# Altium schematic sheet BMD-300-Eval_Top.SchDoc: BMD-300
size B; CompanyName: Rigado, LLC; Organization: Rigado; SheetNumber: 1; Website: www.rigado.com; SheetSize: B; SheetTitle: BMD-300
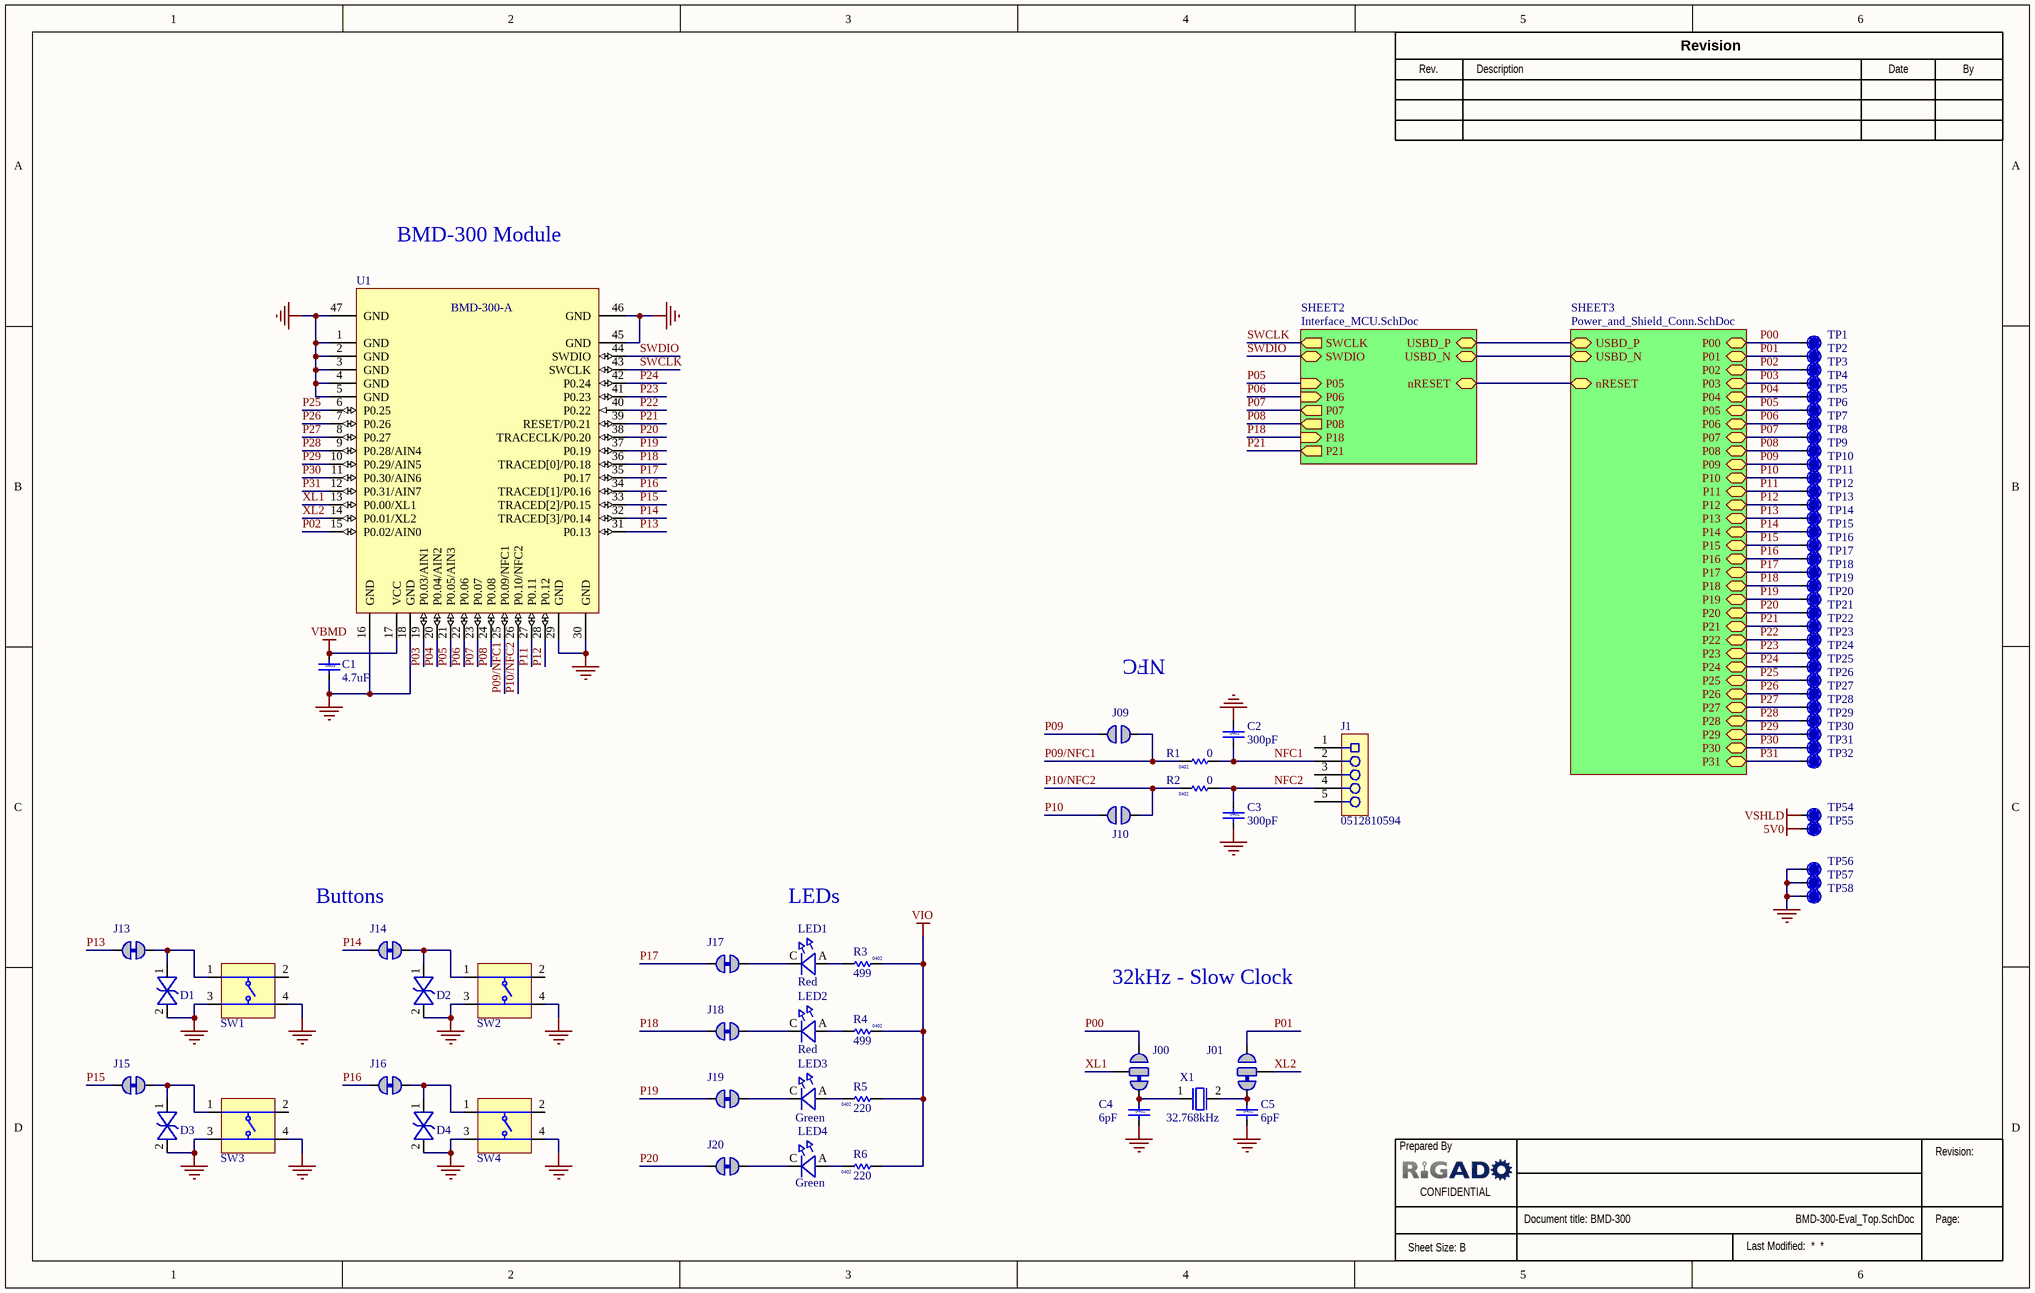
[diagram p0: BMD-300-Eval_Top.SchDoc]

## Parts
(Parts that share a designator on the sheet are numbered #1, #2 ... from top to bottom, then left to right.)
?#1  (no value)  (graphical)
?#2  (no value)  (graphical)
C1  value 4.7uF  Size: 0603  [Cap 0603 HD]  (hidden comment: 120-000324.7uF)
C2  value 300pF  Size: 0402  [Cap 0402 HD]  (hidden comment: 120-00099300pF)
C3  value 300pF  Size: 0402  [Cap 0402 HD]  (hidden comment: 120-00099300pF)
C4  value 6pF  Size: 0402  [Cap 0402 HD]  (hidden comment: 120-000486pF)
C5  value 6pF  Size: 0402  [Cap 0402 HD]  (hidden comment: 120-000486pF)
D1  110-00019  [SOD-923]  (value not drawn)
D2  110-00019  [SOD-923]  (value not drawn)
D3  110-00019  [SOD-923]  (value not drawn)
D4  110-00019  [SOD-923]  (value not drawn)
J00  Solderbridge-OptionDNP  [Solderbridge-Option]  (value not drawn)  (net tie, no BOM)
J1  Manufacturer P/N: 0512810594  [Molex 051281-0594]  (hidden comment: 130-00098)
J01  Solderbridge-OptionDNP  [Solderbridge-Option]  (value not drawn)  (net tie, no BOM)
J09  Solderbridge-OpenDNP  [Solderbridge-Open]  (value not drawn)  (no BOM)
J10  Solderbridge-OpenDNP  [Solderbridge-Open]  (value not drawn)  (no BOM)
J13  Solderbridge-ShortDNP  [Solderbridge-Short]  (value not drawn)  (net tie, no BOM)
J14  Solderbridge-ShortDNP  [Solderbridge-Short]  (value not drawn)  (net tie, no BOM)
J15  Solderbridge-ShortDNP  [Solderbridge-Short]  (value not drawn)  (net tie, no BOM)
J16  Solderbridge-ShortDNP  [Solderbridge-Short]  (value not drawn)  (net tie, no BOM)
J17  Solderbridge-ShortDNP  [Solderbridge-Short]  (value not drawn)  (net tie, no BOM)
J18  Solderbridge-ShortDNP  [Solderbridge-Short]  (value not drawn)  (net tie, no BOM)
J19  Solderbridge-ShortDNP  [Solderbridge-Short]  (value not drawn)  (net tie, no BOM)
J20  Solderbridge-ShortDNP  [Solderbridge-Short]  (value not drawn)  (net tie, no BOM)
LED1  Color: Red  [Diode 0603 HD]  (hidden comment: 115-00020)
LED2  Color: Red  [Diode 0603 HD]  (hidden comment: 115-00020)
LED3  Color: Green  [Diode 0603 HD]  (hidden comment: 115-00019)
LED4  Color: Green  [Diode 0603 HD]  (hidden comment: 115-00019)
R1  value 0  Size: 0402  [RES 0402 HD]  (hidden comment: 180-000200)
R2  value 0  Size: 0402  [RES 0402 HD]  (hidden comment: 180-000200)
R3  value 499  Size: 0402  [RES 0402 HD]  (hidden comment: 180-00031499)
R4  value 499  Size: 0402  [RES 0402 HD]  (hidden comment: 180-00031499)
R5  value 220  Size: 0402  [RES 0402 HD]  (hidden comment: 180-00098220)
R6  value 220  Size: 0402  [RES 0402 HD]  (hidden comment: 180-00098220)
SW1  135-00002  [SW_TACT_SMT_6mm]  (value not drawn)
SW2  135-00002  [SW_TACT_SMT_6mm]  (value not drawn)
SW3  135-00002  [SW_TACT_SMT_6mm]  (value not drawn)
SW4  135-00002  [SW_TACT_SMT_6mm]  (value not drawn)
TP1  TP  [TP10R]  (value not drawn)
TP2  TP  [TP10R]  (value not drawn)
TP3  TP  [TP10R]  (value not drawn)
TP4  TP  [TP10R]  (value not drawn)
TP5  TP  [TP10R]  (value not drawn)
TP6  TP  [TP10R]  (value not drawn)
TP7  TP  [TP10R]  (value not drawn)
TP8  TP  [TP10R]  (value not drawn)
TP9  TP  [TP10R]  (value not drawn)
TP10  TP  [TP10R]  (value not drawn)
TP11  TP  [TP10R]  (value not drawn)
TP12  TP  [TP10R]  (value not drawn)
TP13  TP  [TP10R]  (value not drawn)
TP14  TP  [TP10R]  (value not drawn)
TP15  TP  [TP10R]  (value not drawn)
TP16  TP  [TP10R]  (value not drawn)
TP17  TP  [TP10R]  (value not drawn)
TP18  TP  [TP10R]  (value not drawn)
TP19  TP  [TP10R]  (value not drawn)
TP20  TP  [TP10R]  (value not drawn)
TP21  TP  [TP10R]  (value not drawn)
TP22  TP  [TP10R]  (value not drawn)
TP23  TP  [TP10R]  (value not drawn)
TP24  TP  [TP10R]  (value not drawn)
TP25  TP  [TP10R]  (value not drawn)
TP26  TP  [TP10R]  (value not drawn)
TP27  TP  [TP10R]  (value not drawn)
TP28  TP  [TP10R]  (value not drawn)
TP29  TP  [TP10R]  (value not drawn)
TP30  TP  [TP10R]  (value not drawn)
TP31  TP  [TP10R]  (value not drawn)
TP32  TP  [TP10R]  (value not drawn)
TP54  TP  [TP10R]  (value not drawn)
TP55  TP  [TP10R]  (value not drawn)
TP56  TP  [TP10R]  (value not drawn)
TP57  TP  [TP10R]  (value not drawn)
TP58  TP  [TP10R]  (value not drawn)
U1  Manufacturer P/N: BMD-300-A  [BMD-300]  (hidden comment: 205-00011)
X1  Frequency: 32.768kHz  [XTAL_3215]  (hidden comment: 100-00005)

## Sub-sheets
SHEET2 = Interface_MCU.SchDoc: USBD_N (bidir), USBD_P (bidir), P21 (out), P18 (in), P08 (out), P06 (in), P07 (out), P05 (in), SWCLK (out), SWDIO (bidir), nRESET (bidir)
SHEET3 = Power_and_Shield_Conn.SchDoc: P00 (bidir), P01 (bidir), P02 (bidir), P03 (bidir), P04 (bidir), P05 (bidir), P06 (bidir), P07 (bidir), P08 (bidir), P09 (bidir), P10 (bidir), P11 (bidir), P14 (bidir), P15 (bidir), P16 (bidir), P12 (bidir), P13 (bidir), P17 (bidir), P18 (bidir), P19 (bidir), P20 (bidir), P21 (bidir), P22 (bidir), P23 (bidir), P24 (bidir), P25 (bidir), P26 (bidir), P27 (bidir), P28 (bidir), P29 (bidir), P30 (bidir), P31 (bidir), USBD_P (bidir), USBD_N (bidir), nRESET (bidir)

## Nets
5V0: TP55.1
GND: C1.2 C2.1 C3.2 C4.2 C5.2 D1.2 D2.2 D3.2 D4.2 SW1.3(T3) SW1.4(T3) SW2.3(T3) SW2.4(T3) SW3.3(T3) SW3.4(T3) SW4.3(T3) SW4.4(T3) TP56.1 TP57.1 TP58.1 U1.1(GND) U1.2(GND) U1.3(GND) U1.4(GND) U1.5(GND) U1.16(GND) U1.18(GND) U1.29(GND) U1.30(GND) U1.45(GND) U1.46(GND) U1.47(GND)
VBMD: C1.1 U1.17(VCC)
VIO: R3.2 R4.2 R5.1 R6.1
VSHLD: TP54.1
NFC1: C2.2 J1.2 R1.1
NFC2: C3.1 J1.4 R2.1
P00: J00.3 TP1.1 ; sheet SHEET3/P00
P01: J01.3 TP2.1 ; sheet SHEET3/P01
P02: TP3.1 U1.15(P0.02/AIN0) ; sheet SHEET3/P02
P03: TP4.1 U1.19(P0.03/AIN1) ; sheet SHEET3/P03
P04: TP5.1 U1.20(P0.04/AIN2) ; sheet SHEET3/P04
P05: TP6.1 U1.21(P0.05/AIN3) ; sheet SHEET3/P05, sheet SHEET2/P05
P06: TP7.1 U1.22(P0.06) ; sheet SHEET3/P06, sheet SHEET2/P06
P07: TP8.1 U1.23(P0.07) ; sheet SHEET3/P07, sheet SHEET2/P07
P08: TP9.1 U1.24(P0.08) ; sheet SHEET3/P08, sheet SHEET2/P08
P09: J09.2 TP10.1 ; sheet SHEET3/P09
P09/NFC1: J09.1 R1.2 U1.25(P0.09/NFC1)
P10: J10.2 TP11.1 ; sheet SHEET3/P10
P10/NFC2: J10.1 R2.2 U1.26(P0.10/NFC2)
P11: TP12.1 U1.27(P0.11) ; sheet SHEET3/P11
P12: TP13.1 U1.28(P0.12) ; sheet SHEET3/P12
P13: J13.2 TP14.1 U1.31(P0.13) ; sheet SHEET3/P13
P14: J14.2 TP15.1 U1.32(TRACED[3]/P0.14) ; sheet SHEET3/P14
P15: J15.2 TP16.1 U1.33(TRACED[2]/P0.15) ; sheet SHEET3/P15
P16: J16.2 TP17.1 U1.34(TRACED[1]/P0.16) ; sheet SHEET3/P16
P17: J17.2 TP18.1 U1.35(P0.17) ; sheet SHEET3/P17
P18: J18.2 TP19.1 U1.36(TRACED[0]/P0.18) ; sheet SHEET3/P18, sheet SHEET2/P18
P19: J19.2 TP20.1 U1.37(P0.19) ; sheet SHEET3/P19
P20: J20.2 TP21.1 U1.38(TRACECLK/P0.20) ; sheet SHEET3/P20
P21: TP22.1 U1.39(RESET/P0.21) ; sheet SHEET3/P21, sheet SHEET2/P21
P22: TP23.1 U1.40(P0.22) ; sheet SHEET3/P22
P23: TP24.1 U1.41(P0.23) ; sheet SHEET3/P23
P24: TP25.1 U1.42(P0.24) ; sheet SHEET3/P24
P25: TP26.1 U1.6(P0.25) ; sheet SHEET3/P25
P26: TP27.1 U1.7(P0.26) ; sheet SHEET3/P26
P27: TP28.1 U1.8(P0.27) ; sheet SHEET3/P27
P28: TP29.1 U1.9(P0.28/AIN4) ; sheet SHEET3/P28
P29: TP30.1 U1.10(P0.29/AIN5) ; sheet SHEET3/P29
P30: TP31.1 U1.11(P0.30/AIN6) ; sheet SHEET3/P30
P31: TP32.1 U1.12(P0.31/AIN7) ; sheet SHEET3/P31
SWCLK: U1.43(SWCLK) ; sheet SHEET2/SWCLK
SWDIO: U1.44(SWDIO) ; sheet SHEET2/SWDIO
XL1: J00.2 U1.13(P0.00/XL1)
XL2: J01.2 U1.14(P0.01/XL2)
NetC4_1: C4.1 J00.1 X1.1
NetC5_1: C5.1 J01.1 X1.2
NetD1_1: D1.1 J13.1 SW1.1(T1)
NetD2_1: D2.1 J14.1 SW2.1(T1)
NetD3_1: D3.1 J15.1 SW3.1(T1)
NetD4_1: D4.1 J16.1 SW4.1(T1)
NetJ17_1: J17.1 LED1.C(Cathode)
NetJ18_1: J18.1 LED2.C(Cathode)
NetJ19_1: J19.1 LED3.C(Cathode)
NetJ20_1: J20.1 LED4.C(Cathode)
NetLED1_A: LED1.A(Anode) R3.1
NetLED2_A: LED2.A(Anode) R4.1
NetLED3_A: LED3.A(Anode) R5.2
NetLED4_A: LED4.A(Anode) R6.2
(unnamed): sheet SHEET3/USBD_P, sheet SHEET2/USBD_P
(unnamed): sheet SHEET3/USBD_N, sheet SHEET2/USBD_N
(unnamed): sheet SHEET3/nRESET, sheet SHEET2/nRESET

Not connected (* = marked no-connect by the designer): J1 1 3 5; SW1 2(T2); SW2 2(T2); SW3 2(T2); SW4 2(T2)

## Notes on the sheet
- BMD-300 Module
- NFC
- (near J14) Buttons
- LEDs
- 32kHz - Slow Clock
- Rev.
- Description
- Revision
- Date
- By
- Prepared By
- Revision:
- CONFIDENTIAL
- Page:

## Library data of the parts
?#1 = Top_Revision_Block: Release Revision History Block
?#2 = Top_Title_Block: Top level schematic title block for top level sheet
C1 = 120-00032: Cap, Ceramic 4.7uF 16V 10% X5R 0603; Part Name: CAP CER 4.7UF 16V 10% X5R 0603; Part_Type: Ceramic Capacitor; Manufacturer: Samsung Electro-Mechanics America, Inc; Manufacturer P/N: CL10A475KO8NNNC; Item_Phase: Production; Component Mounting Type: SMT; Tolerance: +/- 10%; Use in new designs: Yes; Part Number: 120-00032; Supplier 1: Digi-Key; Supplier Part Number 1: 1276-1784-1-ND; Arena Link: https://app.bom.com/a/M4NV18R8RA9QVQMY?v=spec.summary; Height: 0.9mm; Pins: 2; Temperature Coefficient: X5R; Voltage: 16V; Revision: 0A; Manufacturer 2: Taiyo Yuden; Manufacturer P/N 2: EMK107ABJ475KA-T; Supplier 2: Digi-Key; Supplier Part Number 2: 587-2786-1-ND
C2 C3 = 120-00099: CAP CER 300PF 50V NP0 0402; Part_Type: Ceramic Capacitor; Manufacturer: Murata Electronics North America; Manufacturer P/N: GRM1555C1H301JA01D; Item_Phase: Preliminary; Component Mounting Type: SMT; Tolerance: +/- 5%; Use in new designs: Yes; Part Number: 120-00099; Part Name: CAP CER 300PF 50V NP0 0402; Supplier 1: Digi-Key; Supplier Part Number 1: 490-3234-1-ND; Arena Link: https://app.bom.com/a/BTCKQXGXGZYCR3MS?v=spec.summary; Height: 0.55mm; Pins: 2; Temperature Coefficient: NP0; Voltage: 50V
C4 C5 = 120-00048: Cap, Ceramic 6pF 50V NP0 0402  Tolerance = +/-0.5pF; Part Name: CAP CER 6PF 50V NP0 0402; Part_Type: Ceramic Capacitor; Manufacturer: Murata Electronics North America; Manufacturer P/N: GRM1555C1H6R0DA01D; Item_Phase: Production; Component Mounting Type: SMT; Tolerance: Other; Use in new designs: Yes; Part Number: 120-00048; Revision: 0A; Supplier 1: Digi-Key; Supplier Part Number 1: 490-5877-1-ND; Manufacturer 2: TDK Corporation; Manufacturer P/N 2: C1005C0G1H060D050BA; Supplier 2: Digi-Key; Supplier Part Number 2: 445-4885-1-ND; Arena Link: https://app.bom.com/a/9RAIOVEVEXWD41V3?v=spec.summary; Height: 0.55mm; Pins: 2; Temperature Coefficient: NP0; Voltage: 50V
D1-D4 = 110-00019: ESD9B3.3ST5G; Part Name: Diode TVS 3.3V SOD-923; Part_Type: Diode; Manufacturer: ON Semiconductor; Item_Phase: Preliminary; Body Size: 0.8mm x 0.6mm; Component Mounting Type: SMT; Diode Type: TVS; Use in new designs: Yes; Voltage: 3.3V; Part Number: 110-00019; Manufacturer P/N: ESD9B3.3ST5G; Supplier 1: Digi-Key; Supplier Part Number 1: ESD9B3.3ST5GOSCT-ND; Arena Link: https://app.bom.com/a/4M5DJQ9Q9SR7DV4H?v=spec.summary; Height: 0.4mm; MFG Package: SOD-923; Package Type: SOD; Pins: 2
J00 J01 = Solderbridge-Option: Added By: Paul B; Part Number: Solderbridge-Option; Height: 0; DNP: DNP; Added Date: 12/3/2015
J1 = 130-00098: CON FFC/FPC 0.50mm 5Pos R/A; Part_Type: Connector; Manufacturer: Molex Inc; Item_Phase: Preliminary; Component Mounting Type: SMT; Connector Type: FPC; Keyed: No; Pin Pitch: 0.5mm; Rows: 1; Use in new designs: Yes; Voltage: 50V; Part Number: 130-00098; Part Name: CON FFC/FPC 0.50mm 5Pos R/A; Supplier 1: Digi-Key; Supplier Part Number 1: WM9836CT-ND; Arena Link: https://app.bom.com/a/ZH08EL4L4NM1OBQL?v=spec.summary; Color: White; Height: 1.2mm; Length: 4.8mm; Locking: No; Pins: 5; Width: 3.55mm
J09 J10 = Solderbridge-Open: Added By: Paul B; Part Number: Solderbridge-Open; Height: 0; DNP: DNP; Added Date: 12/2/2015
J13-J20 = Solderbridge-Short: Added By: Paul B; Part Number: Solderbridge-Short; Height: 0; DNP: DNP; Added Date: 12/2/2015
LED1 LED2 = 115-00020: LED RED CLEAR 0603 SMD; Manufacturer: Lite-On Inc; Manufacturer P/N: LTST-C191KRKT; Item_Phase: Preliminary; Body Size: 1.60mm x 0.80mm; Component Mounting Type: SMT; Current: 20mA; MFG Package: 0603; Number of Circuits: 1; Use in new designs: Yes; Vf: 2V; Part Number: 115-00020; Part Name: LED RED CLEAR 0603 SMD; Part_Type: LED; Supplier 1: Digi-Key; Supplier Part Number 1: 160-1447-1-ND; Arena Link: https://app.bom.com/a/J1KSY5O5O76K0HBF?v=spec.summary; Height: 0.55mm; Mounting Type: Surface Mount; Size: 0603; Pins: 2
LED3 LED4 = 115-00019: LED GREEN CLEAR 0603 SMD; Manufacturer: Lite-On Inc; Manufacturer P/N: LTST-C190KGKT; Item_Phase: Preliminary; Body Size: 1.60mm x 0.80mm; Component Mounting Type: SMT; Current: 20mA; Use in new designs: Yes; Vf: 2V; Part Number: 115-00019; Part Name: LED GREEN CLEAR 0603 SMD; Part_Type: LED; Supplier 1: Digi-Key; Supplier Part Number 1: 160-1435-1-ND; Arena Link: https://app.bom.com/a/9RAIOVEVEXWBVX8A?v=spec.summary; Height: 0.8mm; Mounting Type: Surface Mount; Size: 0603; Pins: 2
R1 R2 = 180-00020: Resistor 0 ohm 1/16W 0402; Part Name: RES SMD 0.0 OHM JUMPER 1/16W; Manufacturer: Rohm Semiconductor; Manufacturer P/N: MCR01MRTJ000; Item_Phase: Production; Component Mounting Type: SMT; Use in new designs: Yes; Part Number: 180-00020; Part_Type: Resistor; Revision: 0A; Supplier 1: Digi-Key; Supplier Part Number 1: RHM0.0CECT-ND; Manufacturer 2: Samsung Electro-Mechanics America, Inc; Manufacturer P/N 2: RC1005J000CS; Supplier 2: Digi-Key; Supplier Part Number 2: 1276-3480-1-ND; Arena Link: https://app.bom.com/a/ASBJPWFWFYXELOFM?v=spec.summary; Height: 0.40mm; Pins: 2; Power: 1/16W; Voltage: N/A
R3 R4 = 180-00031: Resistor 499 ohm 1%, 1/16W, 0402; Part Name: RES SMD 499 OHM 1% 1/16W 0402; Manufacturer: Rohm Semiconductor; Manufacturer P/N: MCR01MRTF4990; Item_Phase: Preliminary; Component Mounting Type: SMT; Tolerance: +/- 1%; Use in new designs: Yes; Part Number: 180-00031; Part_Type: Resistor; Supplier 1: Digi-Key; Supplier Part Number 1: RHM499CDCT-ND; Manufacturer 2: Samsung Electro-Mechanics America, Inc; Manufacturer P/N 2: RC1005F4990CS; Arena Link: https://app.bom.com/a/Q8RZ5CVCVEDU1SS5?v=spec.summary; Height: 0.4mm; Pins: 2; Power: 1/16W
R5 R6 = 180-00098: RC1005J221CS; Part Name: RES SMD 220 OHM 5% 1/16W 0402; Part_Type: Resistor; Manufacturer: Samsung Electro-Mechanics America, Inc; Item_Phase: Preliminary; Component Mounting Type: SMT; Power: 1/16W; Tolerance: +/- 5%; Use in new designs: Yes; Part Number: 180-00098; Manufacturer P/N: RC1005J221CS; Supplier 1: Digi-Key; Supplier Part Number 1: 1276-4360-1-ND; Arena Link: https://app.bom.com/a/8Q9HNUDUDWVBJC30?v=spec.summary; Pins: 2
SW1-SW4 = 135-00002: Tactile Switch, SPST-NO, SMT 160gf.; Part Name: Button Tactile SPST-NO 50mA 6mm SMT; Part_Type: Button; Manufacturer: C&K Components; Manufacturer P/N: PTS645SM43SMTR92 LFS; Item_Phase: Preliminary; Body Size: 6mm x 6mm; Current: 50mA; Switch/Button Circuit: SPST; Switch/Button Function: Off-Mom; Use in new designs: Yes; Voltage: 12VDC; Part Number: 135-00002; Supplier 1: Digi-Key; Supplier Part Number 1: CKN9112CT-ND; Arena Link: https://app.bom.com/a/L3MU07Q7Q98QQQW6?v=spec.summary; Component Mounting Type: SMT; Height: 4.3mm; Pins: 4
TP1-TP32 TP54-TP58 = TP10R: Testpoint, Round 1.0mm Dia; Added By: Jeremy D; Part Number: TP10R; Size: 1.0mm; Height: 0; DNP: DNP; Added Date: 2/1/2015; Checked By: Paul B; Checked Date: 2/5/2015
U1 = 205-00011: Bluetooth 4.2 LE SoM, 512kB Flash, 64kB RAM, nRF52832-based; Part_Type: Module; Manufacturer: Rigado; Item_Phase: Preliminary; Body Size: 14.0mm x 9.8mm; BT SIG pre-certified: Yes; Component Mounting Type: SMT; Core Architecture: Cortex-M4F; Pre-certified: FCC, IC, CE, TELEC, Bluetooth SIG; RF Frequency: 2.4GHz; RF Protocol: Bluetooth LE; SMT Pitch: 1.1mm; Voltage: 3.6V; Part Number: 205-00011; Part Name: BMD-300-A; Supplier 1: Rigado; Supplier Part Number 1: BMD-300-A; Arena Link: https://app.bom.com/a/1J2AGN6N6PO2IX53?v=spec.summary; Flash Size: 512kB; Height: 1.9mm; Internal Antenna: Yes; Package Type: LGA; Pins: 47; RAM Size: 64kB; Use in new designs: Yes
X1 = 100-00005: XTAL, 2Pin, 32.768kHz, 7pF 20ppm; Manufacturer P/N: SC32S-7PF20PPM; Part Name: XTAL 2Pin 32.768kHz 3215 7pF; Part_Type: Crystal/Oscillator; Manufacturer: Seiko Instruments; Item_Phase: Production; Body Size: 3.2mm x 1.5mm; Component Mounting Type: SMT; MFG Package: 2-SMD; Use in new designs: Yes; Part Number: 100-00005; Revision: 0A; Supplier 1: Digi-Key; Supplier Part Number 1: 728-1074-1-ND; Manufacturer 2: AVX Corporation; Manufacturer P/N 2: ST3215SB32768C0HPWBB; Supplier 2: Digi-Key; Supplier Part Number 2: 1253-1113-1-ND; Arena Link: https://app.bom.com/a/L3MU07Q7Q98O5PC8?v=spec.summary; CL: 7pF; Frequency Tolerance: 20ppm; Height: 0.9mm; Pins: 2